# EAGLE design schematic (1) (EAGLE 9.6.2)
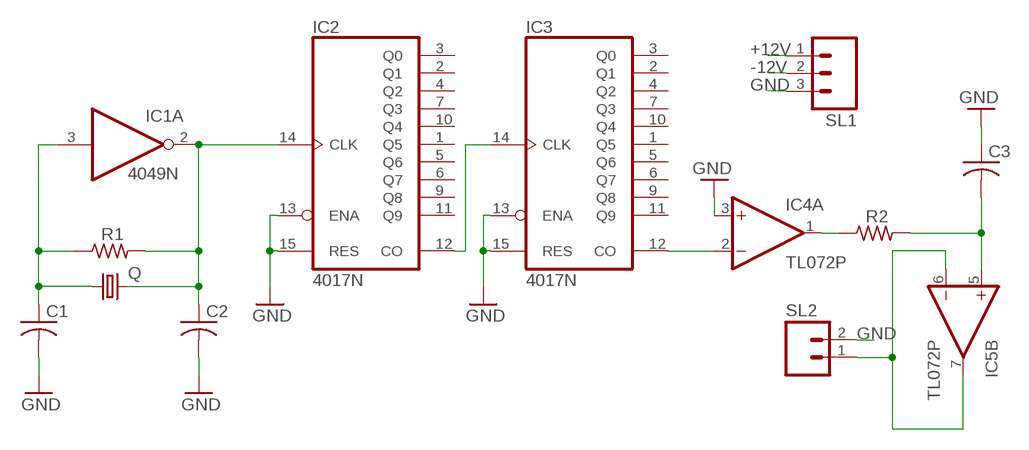
[diagram p0: schematic, sheet 1]

## Parts
C1  C-US025-024X044  [C025-024X044]
C2  C-US025-024X044  [C025-024X044]
C3  C-US025-024X044  [C025-024X044]
IC1  4049N  [DIL16]
IC2  4017N  [DIL16]
IC3  4017N  [DIL16]
IC4  TL072P  [DIL08]
IC5  TL072P  [DIL08]
Q  CRYSTALHC49S  [HC49/S]
R1  R-US_0204/7  [0204/7]
R2  R-US_0204/7  [0204/7]
SL1  M03  [03P]
SL2  M02  [02P]

## Nets
+12V: SL1.1
-12V: SL1.2
GND: C1.2 C2.2 C3.1 IC2.13(ENA) IC2.15(RES) IC3.13(ENA) IC3.15(RES) IC4.3(A:+IN) SL1.3 SL2.2
N$2: C1.1 IC1.3(A:I) Q.1 R1.1
N$8: C2.1 IC1.2(A:O) IC2.14(CLK) Q.2 R1.2
N$10: IC2.12(CO) IC3.14(CLK)
N$11: IC3.12(CO) IC4.2(A:-IN)
N$13: IC4.1(A:OUT) R2.1
N$14: C3.2 IC5.5(B:+IN) R2.2
N$15: IC5.6(B:-IN) IC5.7(B:OUT) SL2.1
Unconnected: IC1.4(B:O) IC1.5(B:I) IC1.6(C:O) IC1.7(C:I) IC1.9(D:I) IC1.10(D:O) IC1.11(E:I) IC1.12(E:O) IC1.14(F:I) IC1.15(F:O) IC2.1(Q5) IC2.2(Q1) IC2.3(Q0) IC2.4(Q2) IC2.5(Q6) IC2.6(Q7) IC2.7(Q3) IC2.9(Q8) IC2.10(Q4) IC2.11(Q9) IC3.1(Q5) IC3.2(Q1) IC3.3(Q0) IC3.4(Q2) IC3.5(Q6) IC3.6(Q7) IC3.7(Q3) IC3.9(Q8) IC3.10(Q4) IC3.11(Q9) IC4.5(B:+IN) IC4.6(B:-IN) IC4.7(B:OUT) IC5.1(A:OUT) IC5.2(A:-IN) IC5.3(A:+IN)

## Power pins joined to a net without a drawn wire
+12V: IC1.1(P:VDD) IC2.16(VDD) IC3.16(VDD) IC4.8(P:V+) IC5.8(P:V+)
-12V: IC4.4(P:V-) IC5.4(P:V-)
GND: IC1.8(P:VSS) IC2.8(VSS) IC3.8(VSS)

## Library data of the parts
C1-C3 = rcl:C-US: CAPACITOR, American symbol; SPICEPREFIX: C
IC1 = 40xx:4049: Hex inverting BUFFER
IC2 IC3 = 40xx:4017: COUNTER/DIVIDER
IC4 IC5 = linear:TL072: OP AMP
Q = crystal:CRYSTAL: CRYSTAL; OC_FARNELL: 1667008; OC_NEWARK: unknown
R1 R2 = rcl:R-US_: RESISTOR, American symbol; SPICEPREFIX: R
SL1 = con-amp-quick:M03: AMP QUICK CONNECTOR; OC_FARNELL: unknown; OC_NEWARK: unknown
SL2 = con-amp-quick:M02: AMP QUICK CONNECTOR; OC_FARNELL: unknown; OC_NEWARK: unknown

## Board
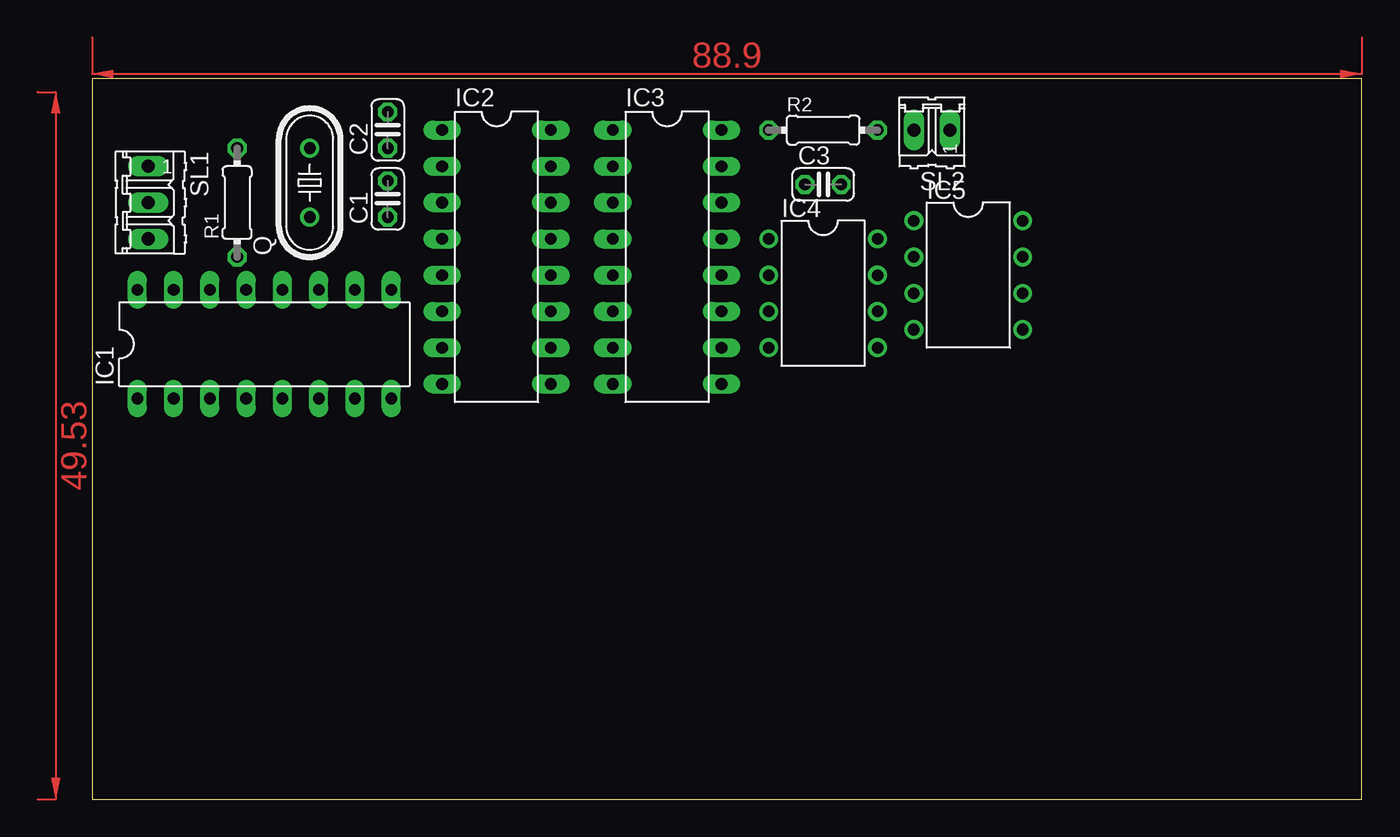
[diagram p1: board, top side]
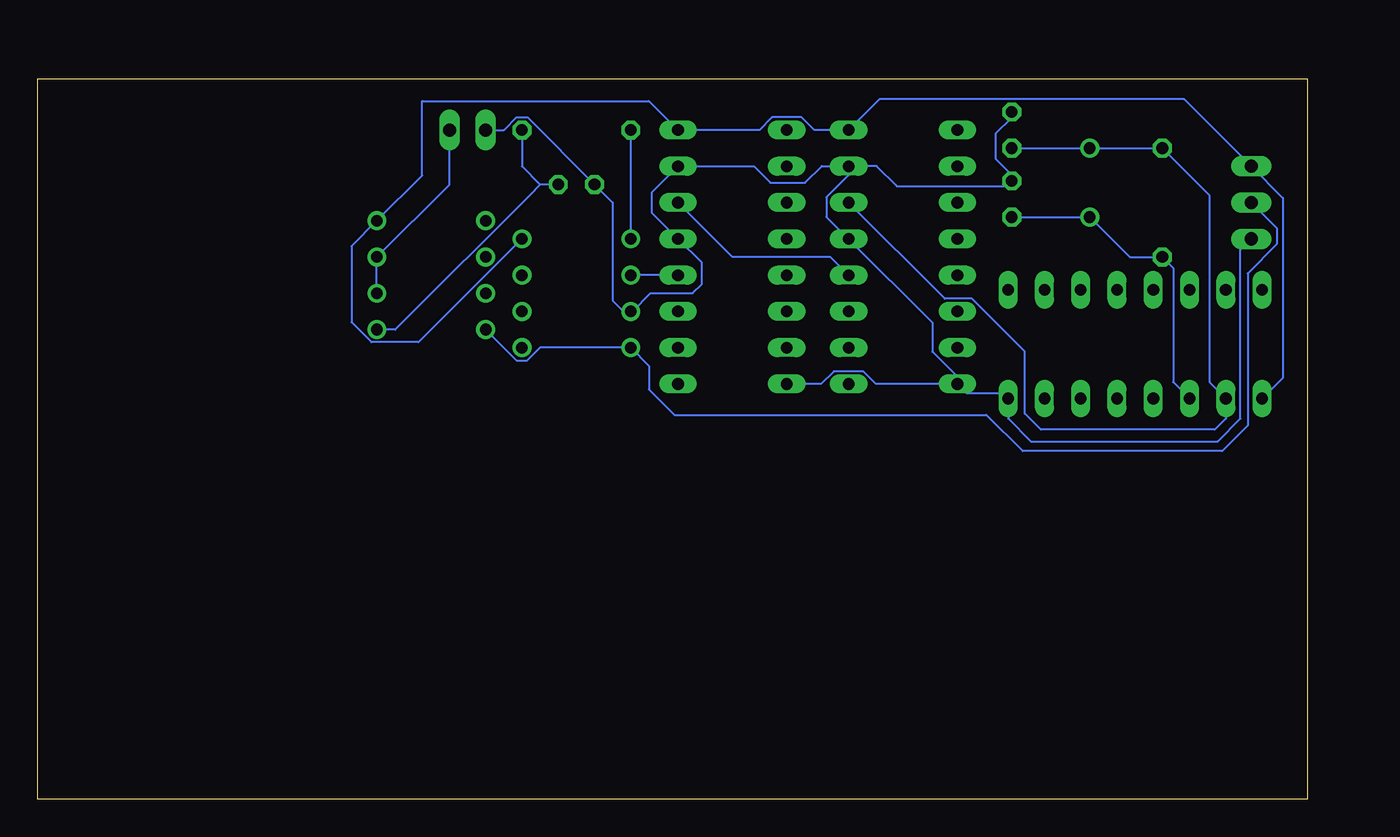
[diagram p2: board, bottom side, seen from below]

Size 88.88 x 50.47 mm. Coordinates in mm from the lower left corner, seen from the top.
Outline: 0,0 88.88,0 88.88,50.47 0,50.47 0,0
Copper layers (1*16): Top 0.035mm / dielectric 1.5mm / Bottom 0.035mm
Design rules "default": minimum track width 6mil, minimum drill 0.35mm, track to track 6mil, track to pad 6mil, pad to pad 6mil, via to via 6mil, smd to smd 6mil, copper to edge 40mil, drill to drill 6mil, minimum pad ring 10mil, minimum via ring 8mil, stop-mask expansion 4mil, vias tented up to drill 0mil, thermal gap 10mil

### Footprints (pad centres in the part's own frame; a part is rotated, then mirrored left to right if it is on the bottom)
C025-024X044 = drill 0.813 octagon: 1 -1.27,0; 2 1.27,0
DIL16 = drill 0.813 long: 1 -8.89,-3.81; 2 -6.35,-3.81; 3 -3.81,-3.81; 4 -1.27,-3.81; 5 1.27,-3.81; 6 3.81,-3.81; 7 6.35,-3.81; 8 8.89,-3.81; 9 8.89,3.81; 10 6.35,3.81; 11 3.81,3.81; 12 1.27,3.81; 13 -1.27,3.81; 14 -3.81,3.81; 15 -6.35,3.81; 16 -8.89,3.81
DIL08 = drill 0.813 pad 1.27: 1 -3.81,-3.81; 2 -1.27,-3.81; 3 1.27,-3.81; 4 3.81,-3.81; 5 3.81,3.81; 6 1.27,3.81; 7 -1.27,3.81; 8 -3.81,3.81
HC49/S = drill 0.813: 1 -2.413,0; 2 2.413,0
0204/7 = drill 0.813 octagon: 1 -3.81,0; 2 3.81,0
03P = drill 0.914 long: 1 -2.54,0; 2 0,0; 3 2.54,0
02P = drill 0.914 long: 1 -1.27,0; 2 1.27,0

### Placement (x,y rotation side)
C1  20.7,42.04 90 top
C2  20.7,46.86 90 top
C3  51.18,43.05 0 top
IC1  12.06,31.88 0 top
IC2  28.32,37.97 270 top
IC3  40.26,37.97 270 top
IC4  51.18,35.43 270 top
IC5  61.34,36.7 270 top
Q  15.24,43.18 90 top
R1  10.16,41.78 90 top
R2  51.18,46.86 0 top
SL1  3.94,41.78 270 top
SL2  58.8,46.86 180 top

### Tracks (layer width: path | path; a pad name or v marks a point on that pad's centre or on a via)
+12V
  Bottom 0.152: IC4.8 55,39.24 62.24,32 65.52,32 66.93,33.41 66.93,38.73 IC5.8 61.98,43.69 61.98,48.89 46.1,48.89 IC3.16 38.37,46.86 37.48,47.75 35.42,47.75 34.53,46.86 IC2.16 29.97,49.02 8.64,49.02 SL1.1 1.73,42.11 1.73,29.52 IC1.1
-12V
  Bottom 0.152: SL1.2 3.93,41.78 2.13,39.99 2.13,38.88 4.19,36.82 4.19,26.16 5.97,24.38 19.94,24.38 22.48,26.92 44.32,26.92 46.1,28.7 46.1,30.35 IC4.4 53.73,31.62 54.62,30.73 55.37,30.73 IC5.4
GND
  Bottom 0.152: SL2.2 56.25,46.86 55.36,47.75 54.61,47.75 C3.1 48.64,41.78 48.64,34.92 47.88,34.16 IC4.3 47.24,34.16 45.97,35.43 43.04,35.43 42.39,36.08 42.39,37.58 44.06,39.24 IC3.13 44.08,39.24 45.87,41.03 45.87,42.53 44.08,44.32 IC3.15 38.75,44.32 37.6,43.18 35.17,43.18 34,44.35 32.16,44.35 IC2.15 | IC2.15 32.13,43.7 33.68,42.15 33.68,40.78 32.14,39.24 IC2.13 32.12,39.24 26.26,33.39 26.26,31.34 24.51,29.59 IC2.8 | IC2.8 30.21,29.08 31.1,29.97 33.16,29.97 34.05,29.08 IC3.8 | IC2.8 23.88,28.45 21.34,28.45 IC1.8 20.95,26.66 19.37,25.07 6.29,25.07 4.7,26.66 4.7,38.48 SL1.3 | C2.2 20.7,47.74 21.84,46.6 21.84,44.84 20.7,43.7 C1.2 20.7,43.18 20.95,42.93 28.75,42.93 30.18,44.35 32.11,44.35 IC2.15
N$2
  Bottom 0.152: C1.1 Q.1 12.45,37.97 R1.1 9.4,37.21 9.4,29.21 IC1.3
N$8
  Bottom 0.152: C2.1 Q.2 R1.2 6.86,42.29 6.86,29.21 IC1.2 5.71,26.66 6.49,25.88 18.66,25.88 19.79,27.01 19.79,31.36 23.48,35.05 25.4,35.05 IC2.14
N$10
  Bottom 0.152: IC2.12 33.4,37.97 40.26,37.97 IC3.14
N$11
  Bottom 0.152: IC3.12 IC4.2
N$13
  Bottom 0.152: IC4.1 R2.1
N$14
  Bottom 0.152: R2.2 54.99,44.32 53.72,43.05 | C3.2 53.72,43.05 | 53.72,43.05 54.1,42.67 54.09,42.67 63.87,32.89 IC5.5
N$15
  Bottom 0.152: IC5.6 IC5.7 60.07,43.05 SL2.1
(copper drawn outside any net)
  shapes: Top area x2